# Altium schematic sheet Conn9g.SchDoc
size A
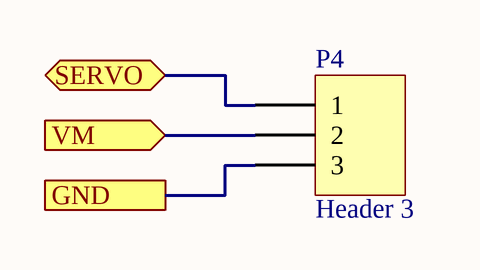
[diagram p0: Conn9g.SchDoc]

## Parts
P4  Header 3  [HDR1X3]

## Ports
GND, SERVO (bidir), VM (in)

## Nets
GND: P4.3 ; port GND
SERVO: P4.1 ; port SERVO
VM: P4.2 ; port VM

## Library data of the parts
P4 = Header 3: Header, 3-Pin; LatestRevisionDate: 17-Jul-2002; LatestRevisionNote: Re-released for DXP Platform.; Publisher: Altium Limited